# EAGLE design maintemp_revised_edition_2_20_18 (EAGLE 8.2.2)
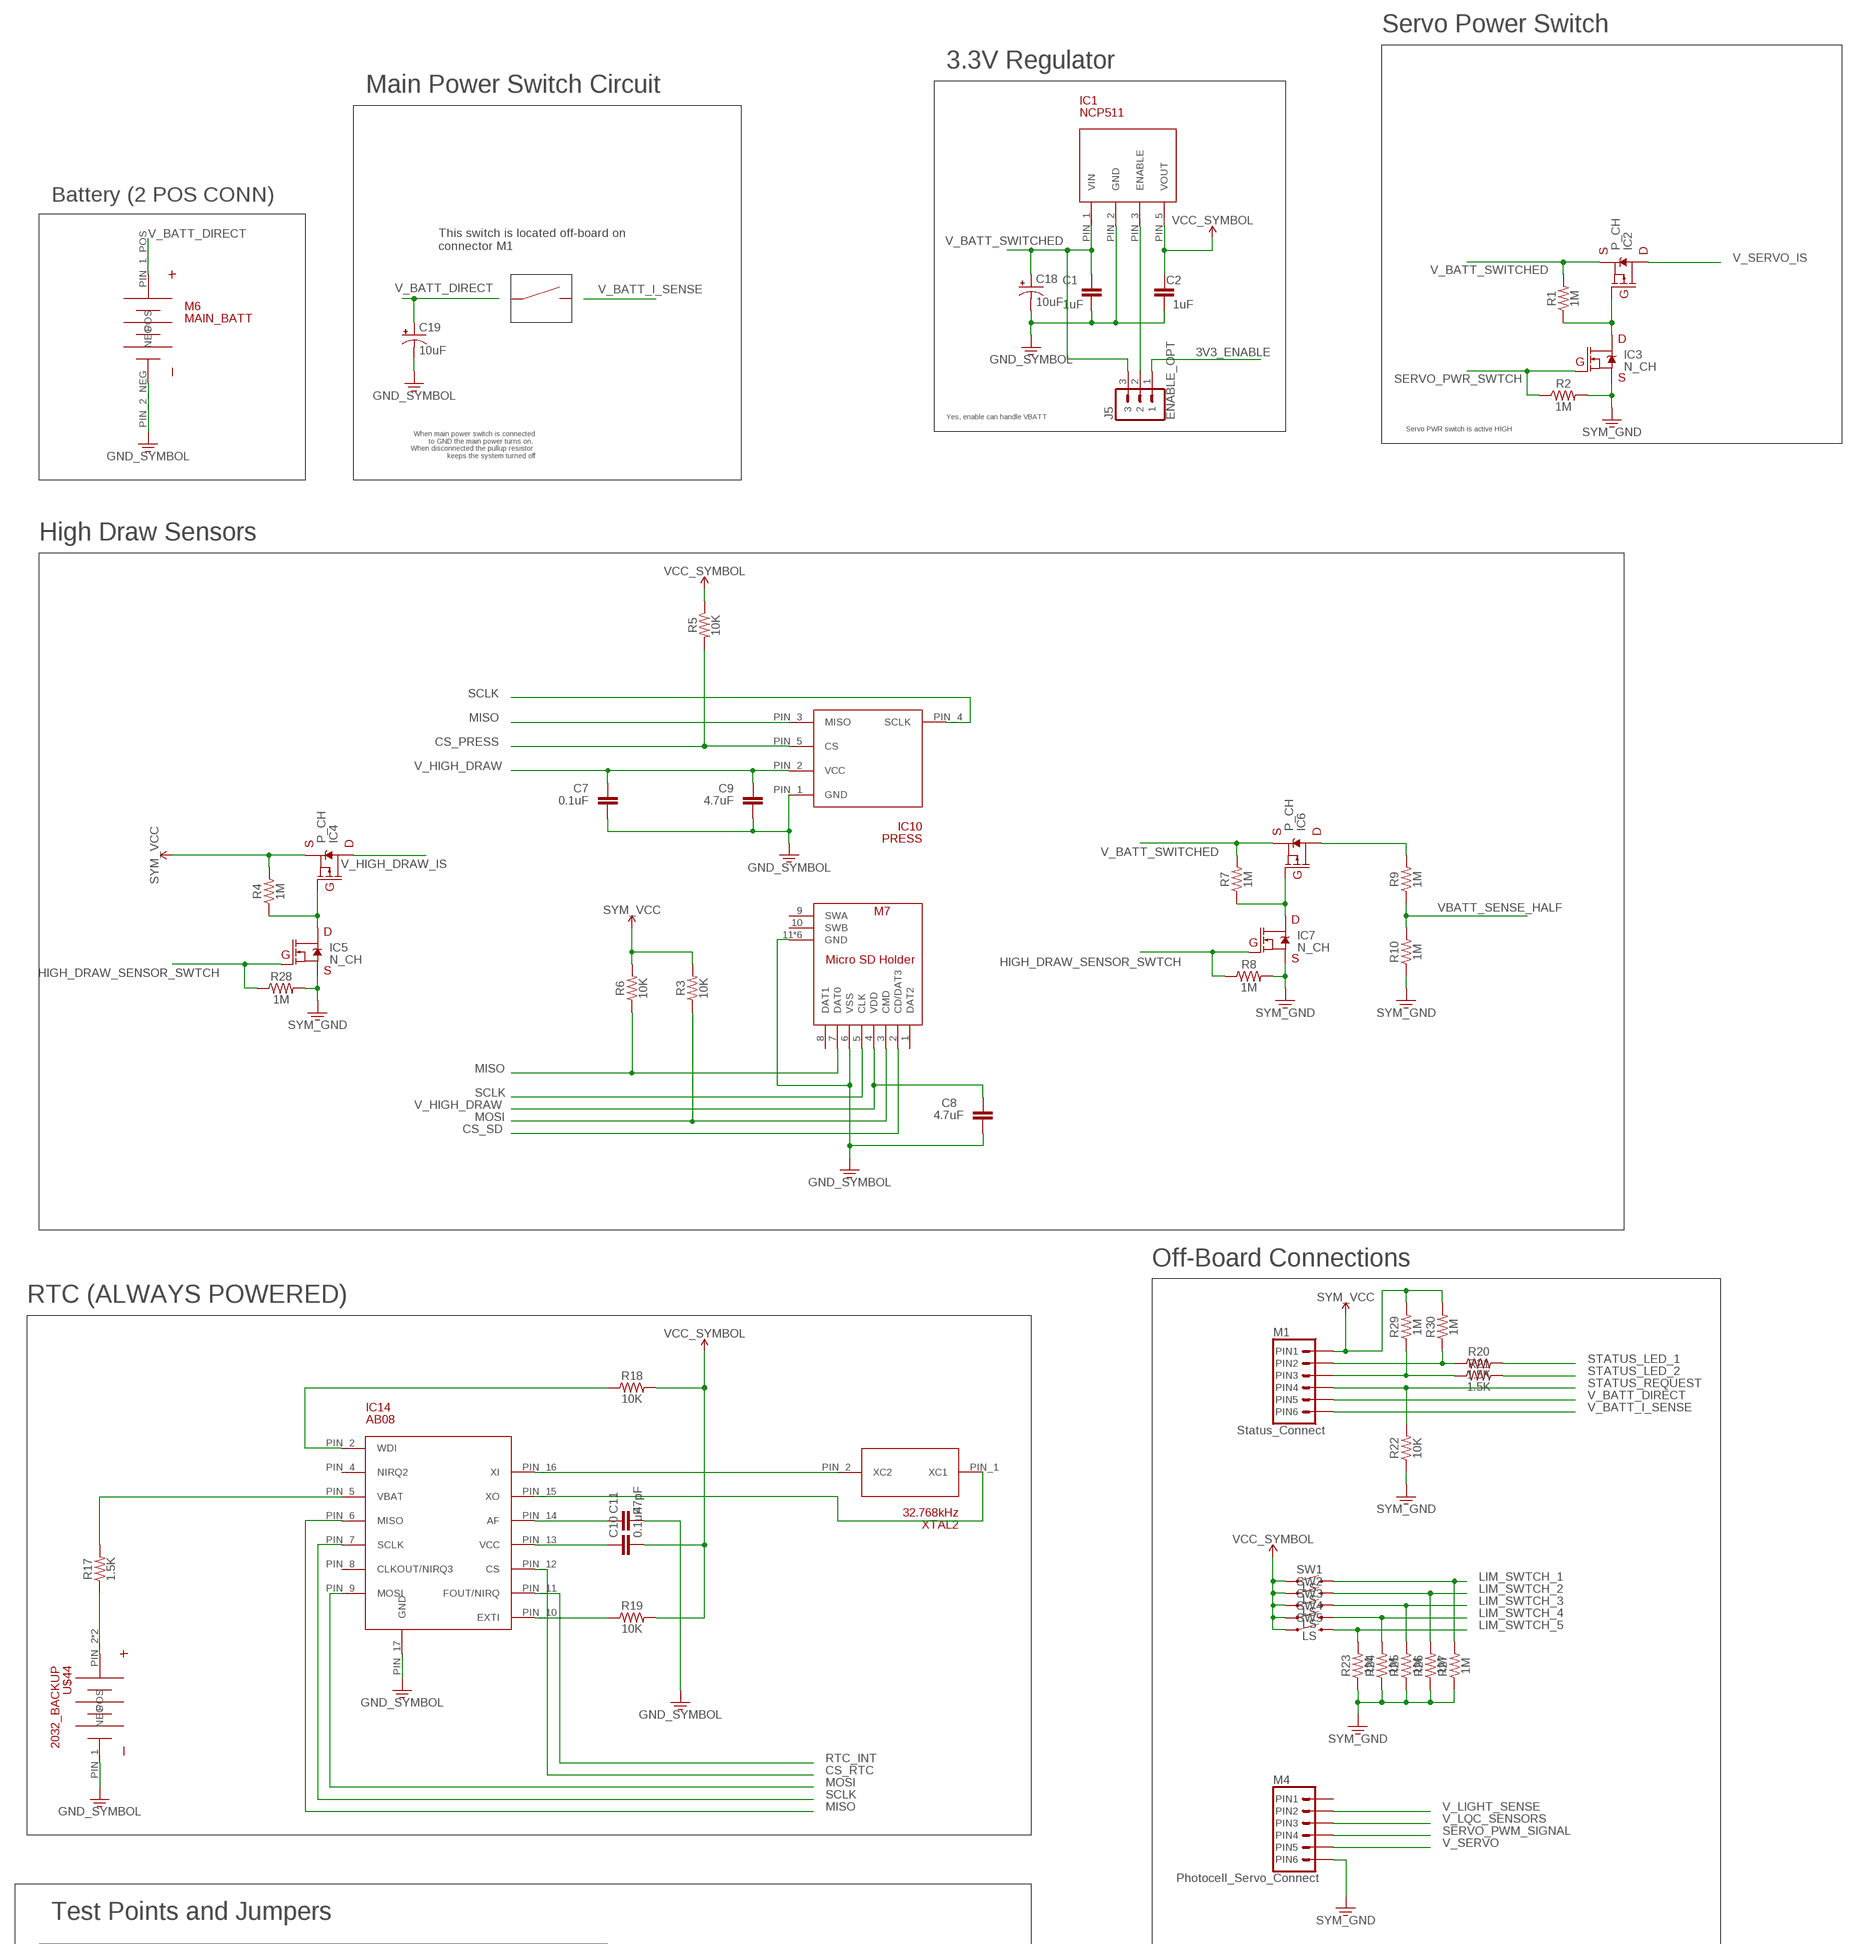
[diagram p0: schematic, sheet 1, part 1 of 3]
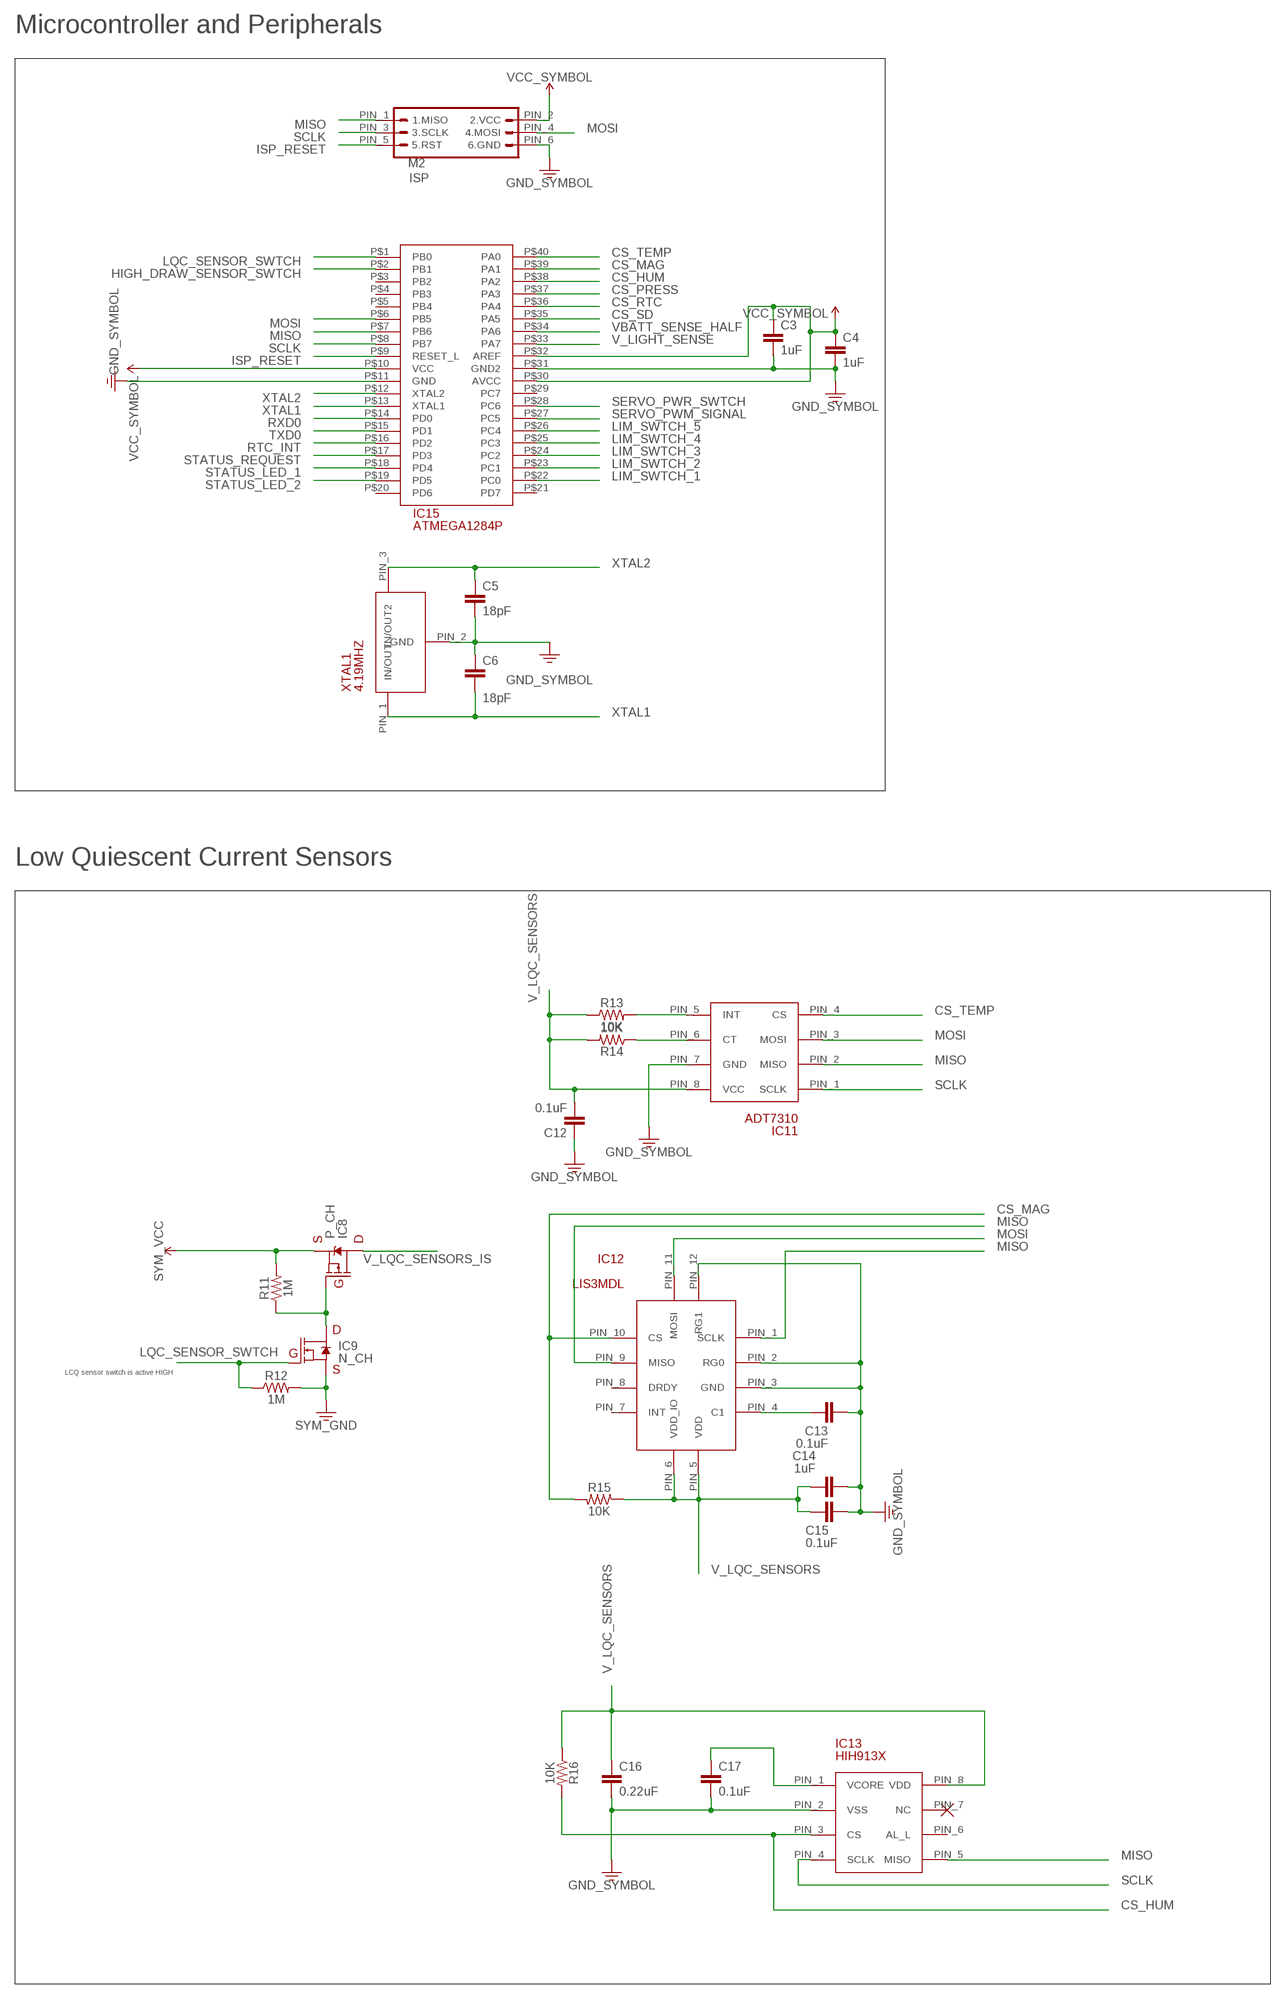
[diagram p1: schematic, sheet 1, part 2 of 3]
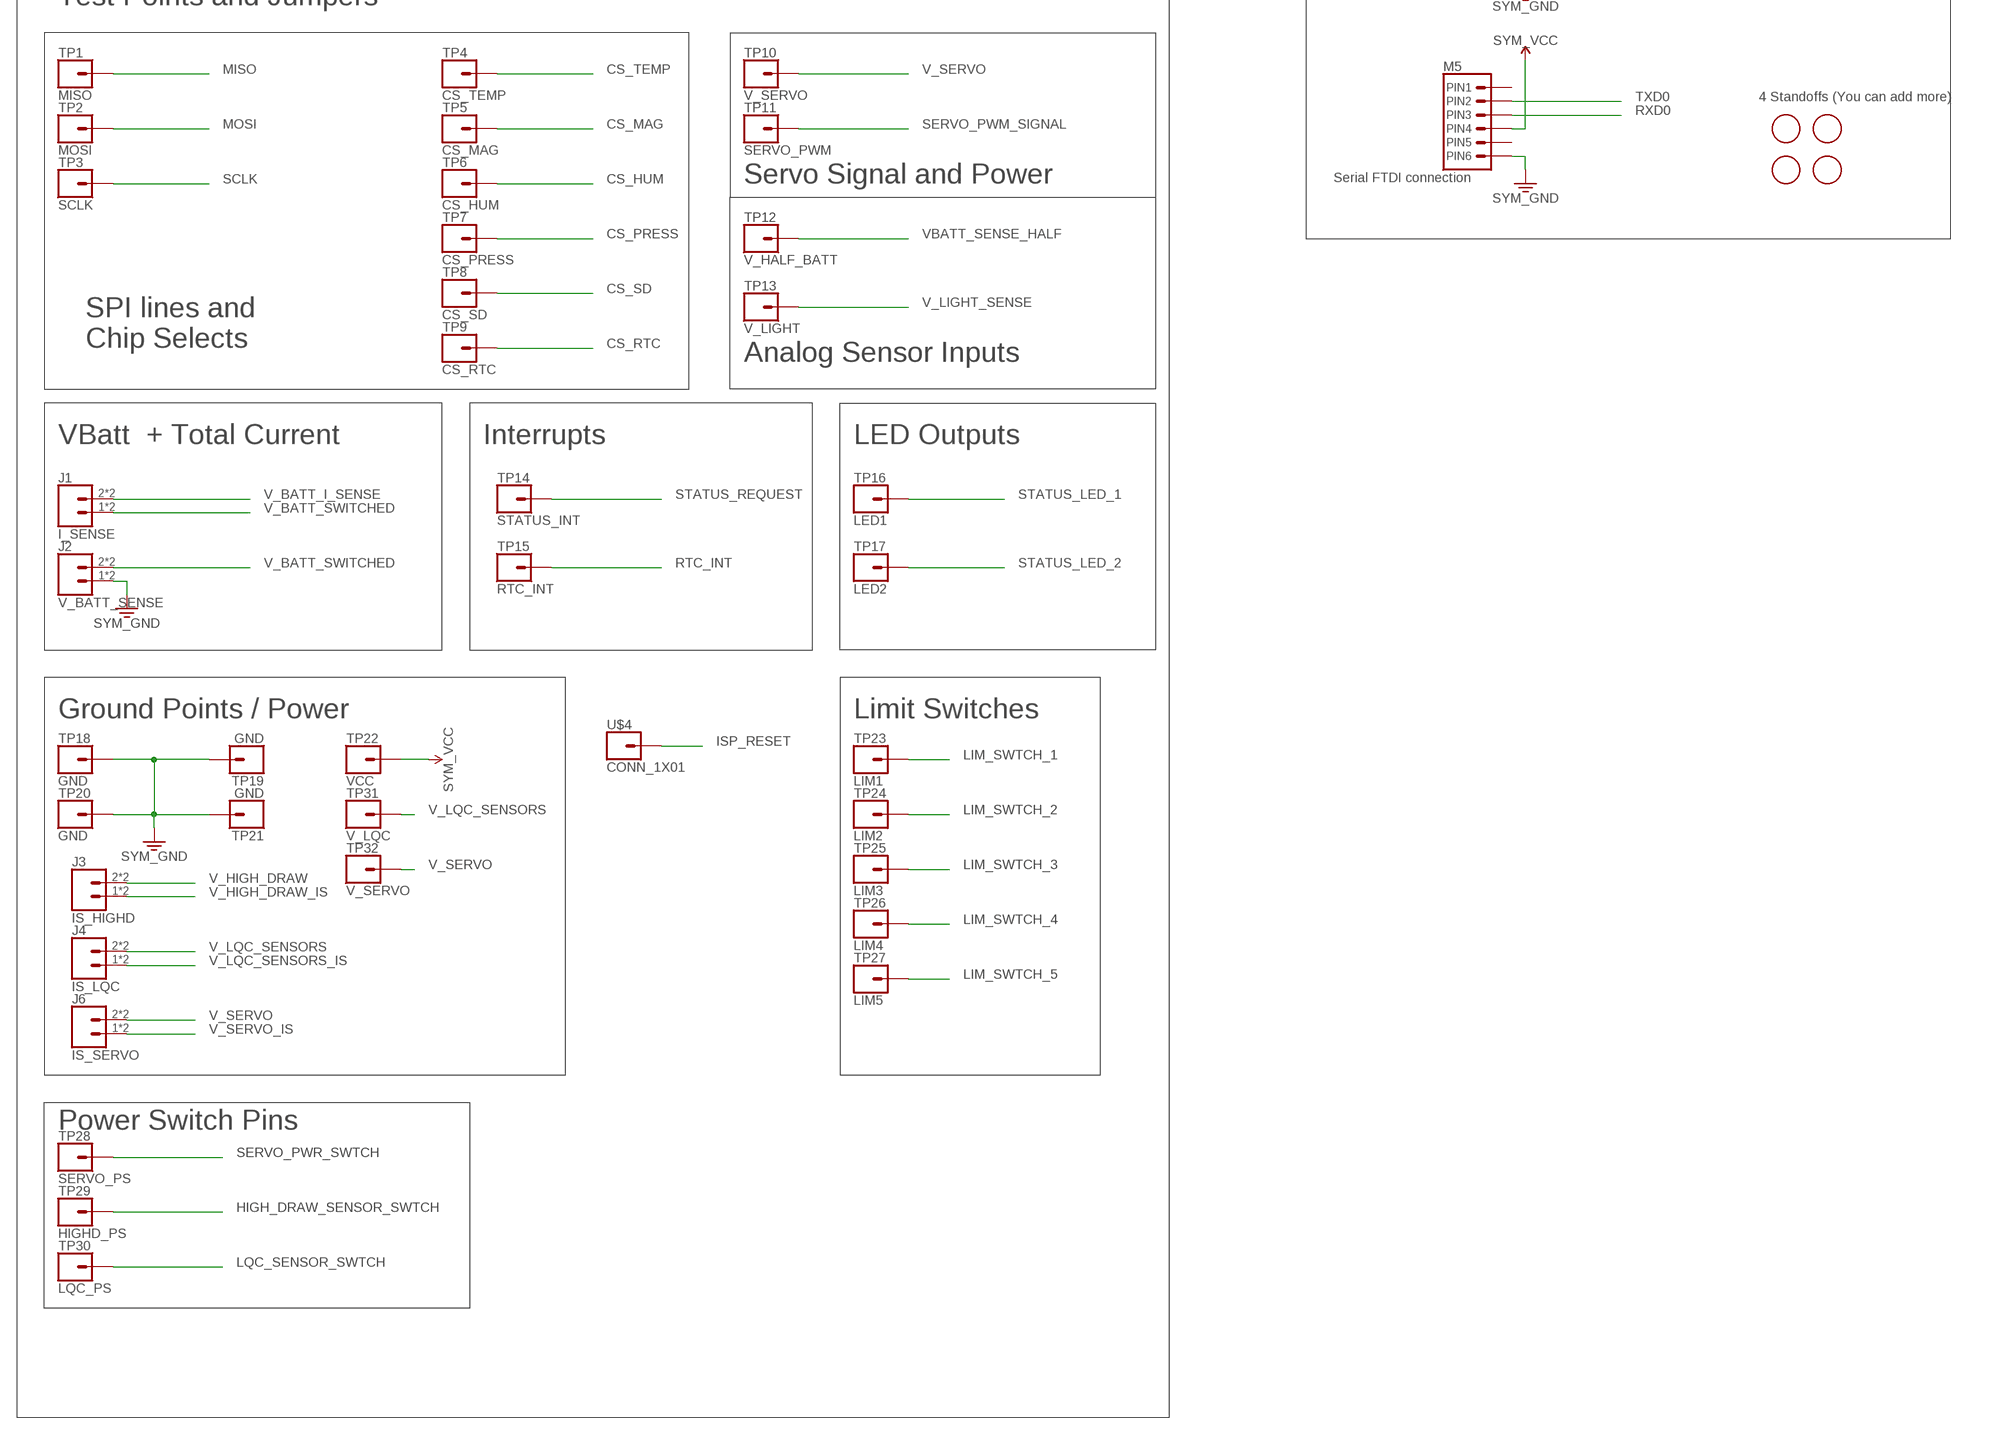
[diagram p2: schematic, sheet 1, part 3 of 3]

## Parts
C1  1uF  CAP_1UF  [SMD_0603]
C2  1uF  CAP_1UF  [SMD_0603]
C3  1uF  CAP_1UF  [SMD_0603]
C4  1uF  CAP_1UF  [SMD_0603]
C5  18pF  CAP_18PF  [SMD_0603]
C6  18pF  CAP_18PF  [SMD_0603]
C7  0.1uF  CAP_0.1UF  [SMD_0603]
C8  4.7uF  CAP_4.7UF  [SMD_0603]
C9  4.7uF  CAP_4.7UF  [SMD_0603]
C10  0.1uF  0.1UF_CAP  [0603]
C11  47pF  47PF_CAP  [0603]
C12  0.1uF  CAP_0.1UF  [SMD_0603]
C13  0.1uF  CAP_0.1UF  [SMD_0603]
C14  1uF  CAP_1UF  [SMD_0603]
C15  0.1uF  CAP_0.1UF  [SMD_0603]
C16  0.22uF  CAP_0.22UF  [SMD_0603]
C17  0.1uF  CAP_0.1UF  [SMD_0603]
C18  10uF  CAP_ELECTRO  [CAP-PTH-2.54]
C19  10uF  CAP_ELECTRO  [CAP-PTH-2.54]
IC1  NCP511  REG_NCP511  [TSOP-5]
IC2  P_CH  ZMISC_MOSFET_P_CHANNEL  [SOT23]
IC3  N_CH  ZMISC_MOSFET_N_CHANNEL  [SOT23]
IC4  P_CH  ZMISC_MOSFET_P_CHANNEL  [SOT23]
IC5  N_CH  ZMISC_MOSFET_N_CHANNEL  [SOT23]
IC6  P_CH  ZMISC_MOSFET_P_CHANNEL  [SOT23]
IC7  N_CH  ZMISC_MOSFET_N_CHANNEL  [SOT23]
IC8  P_CH  ZMISC_MOSFET_P_CHANNEL  [SOT23]
IC9  N_CH  ZMISC_MOSFET_N_CHANNEL  [SOT23]
IC10  PRESS  SENS_PRESS_RSC  [8-DIP]
IC11  ADT7310  TEMP_ADT7310  [SOIC-8]
IC12  LIS3MDL  MAG_LIS3MDL  [LGA-12]
IC13  HIH913X  HUM_HIH913X  [SOIC-8]
IC14  AB08  RTC_AB08  [QFN16_3X3]
IC15  ATMEGA1284P  UC_ATMEGA1284P  [40-DIP]
J1  I_SENSE  ZMISC_JUMPER  [1X02]
J2  V_BATT_SENSE  ZMISC_JUMPER  [1X02]
J3  IS_HIGHD  ZMISC_JUMPER  [1X02]
J4  IS_LQC  ZMISC_JUMPER  [1X02]
J5  ENABLE_OPT  CONN_1X03  [1X03]
J6  IS_SERVO  ZMISC_JUMPER  [1X02]
M1  Status_Connect  CONN_SERIAL  [1X06]
M2  ISP  CONN_ISP  [2X3]
M4  Photocell_Servo_Connect  CONN_SERIAL  [1X06]
M5  Serial FTDI connection  CONN_SERIAL  [1X06]
M6  MAIN_BATT  PWR_MAIN_BATT  [1-1318300-2]
M7  SD  SENS_MICRO-SD  [MICRO-SD]
R1  1M  RES_10K  [SMD_0603]
R2  1M  RES_10K  [SMD_0603]
R3  10K  RES_10K  [SMD_0603]
R4  1M  RES_10K  [SMD_0603]
R5  10K  RES_10K  [SMD_0603]
R6  10K  RES_10K  [SMD_0603]
R7  1M  RES_10K  [SMD_0603]
R8  1M  RES_10K  [SMD_0603]
R9  1M  RES_1M  [SMD_0603]
R10  1M  RES_1M  [SMD_0603]
R11  1M  RES_10K  [SMD_0603]
R12  1M  RES_10K  [SMD_0603]
R13  10K  RES_10K  [SMD_0603]
R14  10K  RES_10K  [SMD_0603]
R15  10K  RES_10K  [SMD_0603]
R16  10K  RES_10K  [SMD_0603]
R17  1.5K  1.5K_RES  [0603]
R18  10K  10K_RES  [0603]
R19  10K  10K_RES  [0603]
R20  1.5K  RES_1.5K  [SMD_0603]
R21  1.5K  RES_1.5K  [SMD_0603]
R22  10K  RES_10K  [SMD_0603]
R23  1M  RES_1M  [SMD_0603]
R24  1M  RES_1M  [SMD_0603]
R25  1M  RES_1M  [SMD_0603]
R26  1M  RES_1M  [SMD_0603]
R27  1M  RES_1M  [SMD_0603]
R28  1M  RES_10K  [SMD_0603]
R29  1M  RES_1M  [SMD_0603]
R30  1M  RES_1M  [SMD_0603]
SW1  LS  LIMITSWITCHBASE  [SNAPSWITCH]
SW2  LS  LIMITSWITCHBASE  [SNAPSWITCH]
SW3  LS  LIMITSWITCHBASE  [SNAPSWITCH]
SW4  LS  LIMITSWITCHBASE  [SNAPSWITCH]
SW5  LS  LIMITSWITCHBASE  [SNAPSWITCH]
TP1  MISO  CONN_1X01  [1X01]
TP2  MOSI  CONN_1X01  [1X01]
TP3  SCLK  CONN_1X01  [1X01]
TP4  CS_TEMP  CONN_1X01  [1X01]
TP5  CS_MAG  CONN_1X01  [1X01]
TP6  CS_HUM  CONN_1X01  [1X01]
TP7  CS_PRESS  CONN_1X01  [1X01]
TP8  CS_SD  CONN_1X01  [1X01]
TP9  CS_RTC  CONN_1X01  [1X01]
TP10  V_SERVO  CONN_1X01  [1X01]
TP11  SERVO_PWM  CONN_1X01  [1X01]
TP12  V_HALF_BATT  CONN_1X01  [1X01]
TP13  V_LIGHT  CONN_1X01  [1X01]
TP14  STATUS_INT  CONN_1X01  [1X01]
TP15  RTC_INT  CONN_1X01  [1X01]
TP16  LED1  CONN_1X01  [1X01]
TP17  LED2  CONN_1X01  [1X01]
TP18  GND  CONN_1X01  [1X01]
TP19  GND  CONN_1X01  [1X01]
TP20  GND  CONN_1X01  [1X01]
TP21  GND  CONN_1X01  [1X01]
TP22  VCC  CONN_1X01  [1X01]
TP23  LIM1  CONN_1X01  [1X01]
TP24  LIM2  CONN_1X01  [1X01]
TP25  LIM3  CONN_1X01  [1X01]
TP26  LIM4  CONN_1X01  [1X01]
TP27  LIM5  CONN_1X01  [1X01]
TP28  SERVO_PS  CONN_1X01  [1X01]
TP29  HIGHD_PS  CONN_1X01  [1X01]
TP30  LQC_PS  CONN_1X01  [1X01]
TP31  V_LQC  CONN_1X01  [1X01]
TP32  V_SERVO  CONN_1X01  [1X01]
U$4  CONN_1X01  [1X01]
U$7  STANDOFF  [STANDOFF]
U$11  STANDOFF  [STANDOFF]
U$13  STANDOFF  [STANDOFF]
U$17  STANDOFF  [STANDOFF]
U$44  2032_BACKUP  [2032]
XTAL1  4.19MHZ  ZMISC_XC  [AT49]
XTAL2  32.768kHz  XC_RTC  [ABS07]

## Nets
3V3_ENABLE: J5.1
CS_HUM: IC13.PIN_3(CS) IC15.P$38(PA2) R16.P$2 TP6.1
CS_MAG: IC12.PIN_10(CS) IC15.P$39(PA1) R15.P$2 TP5.1
CS_PRESS: IC10.PIN_5(CS) IC15.P$37(PA3) R5.P$2 TP7.1
CS_RTC: IC14.PIN_12(CS) IC15.P$36(PA4) TP9.1
CS_SD: IC15.P$35(PA5) M7.2(CD/DAT3) TP8.1
CS_TEMP: IC11.PIN_4(CS) IC15.P$40(PA0) TP4.1
GND: C1.P$2 C2.P$1 C3.P$2 C4.P$2 C5.P$2 C6.P$1 C7.P$2 C8.P$1 C9.P$2 C11.2 C12.P$1 C13.P$1 C14.P$1 C15.P$2 C16.P$2 C17.P$2 C18.2(-) C19.2(-) IC1.PIN_2(GND) IC3.2(S) IC5.2(S) IC7.2(S) IC9.2(S) IC10.PIN_1(GND) IC11.PIN_7(GND) IC12.PIN_2(RG0) IC12.PIN_3(GND) IC12.PIN_12(RG1) IC13.PIN_2(VSS) IC14.PIN_17(GND) IC15.P$11(GND) IC15.P$31(GND2) J2.1 J2.P$1 M2.PIN_6(6.GND) M4.1(PIN6) M5.1(PIN6) M6.PIN_2_NEG(NEG) M7.6(VSS) M7.11(GND) M7.12(GND) M7.13(GND) M7.14(GND) M7.15(GND) M7.16(GND) R2.P$2 R8.P$2 R10.P$1 R12.P$2 R22.P$1 R23.P$1 R24.P$1 R25.P$1 R26.P$1 R27.P$1 R28.P$2 TP18.1 TP19.1 TP20.1 TP21.1 U$44.PIN_1(NEG) XTAL1.PIN_2(GND) ; supply symbol labelled GND_SYMBOL, SYM_GND
HIGH_DRAW_SENSOR_SWTCH: IC5.1(G) IC7.1(G) IC15.P$2(PB1) R8.P$1 R28.P$1 TP29.1
ISP_RESET: IC15.P$9(RESET_L) M2.PIN_5(5.RST) U$4.1
LIM_SWTCH_1: IC15.P$22(PC0) R27.P$2 SW1.PIN_2 TP23.1
LIM_SWTCH_2: IC15.P$23(PC1) R26.P$2 SW2.PIN_2 TP24.1
LIM_SWTCH_3: IC15.P$24(PC2) R25.P$2 SW3.PIN_2 TP25.1
LIM_SWTCH_4: IC15.P$25(PC3) R24.P$2 SW4.PIN_2 TP26.1
LIM_SWTCH_5: IC15.P$26(PC4) R23.P$2 SW5.PIN_2 TP27.1
LQC_SENSOR_SWTCH: IC9.1(G) IC15.P$1(PB0) R12.P$1 TP30.1
MISO: IC10.PIN_3(MISO) IC11.PIN_2(MISO) IC12.PIN_1(SCLK) IC12.PIN_9(MISO) IC13.PIN_5(MISO) IC14.PIN_6(MISO) IC15.P$7(PB6) M2.PIN_1(1.MISO) M7.7(DAT0) R6.P$1 TP1.1
MOSI: IC11.PIN_3(MOSI) IC12.PIN_11(MOSI) IC14.PIN_9(MOSI) IC15.P$6(PB5) M2.PIN_4(4.MOSI) M7.3(CMD) R3.P$1 TP2.1
N$1: IC2.1(G) IC3.3(D) R1.P$1
N$5: C17.P$1 IC13.PIN_1(VCORE)
N$6: C13.P$2 IC12.PIN_4(C1)
N$7: IC14.PIN_2(WDI) R18.1
N$8: IC14.PIN_10(EXTI) R19.1
N$9: C10.1 IC14.PIN_13(VCC)
N$10: C11.1 IC14.PIN_14(AF)
N$11: IC14.PIN_15(XO) XTAL2.PIN_1(XC1)
N$12: IC14.PIN_16(XI) XTAL2.PIN_2(XC2)
N$13: R17.1 U$44.PIN_2(POS) U$44.PIN_3(POS)
N$14: IC14.PIN_5(VBAT) R17.2
N$15: IC11.PIN_5(INT) R13.P$2
N$16: IC11.PIN_6(CT) R14.P$1
N$17: IC1.PIN_3(ENABLE) J5.2
N$20: IC6.1(G) IC7.3(D) R7.P$1
N$22: IC4.1(G) IC5.3(D) R4.P$1
N$38: IC8.1(G) IC9.3(D) R11.P$1
N$L1: M1.5(PIN2) R20.P$1 R30.P$1
N$L2: M1.4(PIN3) R21.P$1 R29.P$1
RTC_INT: IC14.PIN_11(FOUT/NIRQ) IC15.P$16(PD2) TP15.1
RXD0: IC15.P$14(PD0) M5.4(PIN3)
SCLK: IC10.PIN_4(SCLK) IC11.PIN_1(SCLK) IC13.PIN_4(SCLK) IC14.PIN_7(SCLK) IC15.P$8(PB7) M2.PIN_3(3.SCLK) M7.5(CLK) TP3.1
SERVO_PWM_SIGNAL: IC15.P$27(PC5) M4.3(PIN4) TP11.1
SERVO_PWR_SWTCH: IC3.1(G) IC15.P$28(PC6) R2.P$1 TP28.1
STATUS_LED_1: IC15.P$18(PD4) R20.P$2 TP16.1
STATUS_LED_2: IC15.P$19(PD5) R21.P$2 TP17.1
STATUS_REQUEST: IC15.P$17(PD3) M1.3(PIN4) R22.P$2 TP14.1
TXD0: IC15.P$15(PD1) M5.5(PIN2)
V_BATT_DIRECT: C19.1(+) M1.2(PIN5) M6.PIN_1_POS(POS)
V_BATT_I_SENSE: J1.2 J1.P$2 M1.1(PIN6)
V_BATT_SENSE_WHOLE: IC6.3(D) R9.P$2
V_BATT_SWITCHED: C1.P$1 C18.1(+) IC1.PIN_1(VIN) IC2.2(S) IC6.2(S) J1.1 J1.P$1 J2.2 J2.P$2 J5.3 R1.P$2 R7.P$2
V_HIGH_DRAW: C7.P$1 C8.P$2 C9.P$1 IC10.PIN_2(VCC) J3.2 J3.P$2 M7.4(VDD)
V_HIGH_DRAW_IS: IC4.3(D) J3.1 J3.P$1
V_LIGHT_SENSE: IC15.P$33(PA7) M4.5(PIN2) TP13.1
V_LQC_SENSORS: C12.P$2 C14.P$2 C15.P$1 C16.P$1 IC11.PIN_8(VCC) IC12.PIN_5(VDD) IC12.PIN_6(VDD_IO) IC13.PIN_8(VDD) J4.2 J4.P$2 M4.4(PIN3) R13.P$1 R14.P$2 R15.P$1 R16.P$1 TP31.1
V_LQC_SENSORS_IS: IC8.3(D) J4.1 J4.P$1
V_SERVO: J6.2 J6.P$2 M4.2(PIN5) TP10.1 TP32.1
V_SERVO_IS: IC2.3(D) J6.1 J6.P$1
VBATT_SENSE_HALF: IC15.P$34(PA6) R9.P$1 R10.P$2 TP12.1
VCC: C2.P$2 C3.P$1 C4.P$1 C10.2 IC1.PIN_5(VOUT) IC4.2(S) IC8.2(S) IC15.P$10(VCC) IC15.P$30(AVCC) IC15.P$32(AREF) M1.6(PIN1) M2.PIN_2(2.VCC) M5.3(PIN4) R3.P$2 R4.P$2 R5.P$1 R6.P$2 R11.P$2 R18.2 R19.2 R29.P$2 R30.P$2 SW1.PIN_1 SW2.PIN_1 SW3.PIN_1 SW4.PIN_1 SW5.PIN_1 TP22.1 ; supply symbol labelled VCC_SYMBOL, SYM_VCC
XTAL1: C6.P$2 IC15.P$13(XTAL1) XTAL1.PIN_1(IN/OUT)
XTAL2: C5.P$1 IC15.P$12(XTAL2) XTAL1.PIN_3(IN/OUT2)
Unconnected: IC12.PIN_7(INT) IC12.PIN_8(DRDY) IC13.PIN_6(AL_L) IC13.PIN_7(NC) IC14.PIN_4(NIRQ2) IC14.PIN_8(CLKOUT/NIRQ3) IC15.P$3(PB2) IC15.P$4(PB3) IC15.P$5(PB4) IC15.P$20(PD6) IC15.P$21(PD7) IC15.P$29(PC7) M4.6(PIN1) M5.2(PIN5) M5.6(PIN1) M7.1(DAT2) M7.8(DAT1) M7.9(SWA) M7.10(SWB)

## Notes on the sheet
- Microcontroller and Peripherals
- Servo Power Switch
- 3.3V Regulator
- Main Power Switch Circuit
- Battery (2 POS CONN)
- This switch is located off-board on 
  connector M1
- Yes, enable can handle VBATT
- When main power switch is connected
   to GND the main power turns on. 
  When disconnected the pullup resistor 
  keeps the system turned off
- Servo PWR switch is active HIGH
- High Draw Sensors
- Low Quiescent Current Sensors
- Off-Board Connections
- RTC (ALWAYS POWERED)
- LCQ sensor switch is active HIGH
- Test Points and Jumpers
- 4 Standoffs (You can add more)
- Servo Signal and Power
- SPI lines and 
  Chip Selects
- Analog Sensor Inputs
- VBatt  + Total Current | Interrupts | LED Outputs
- Ground Points / Power | Limit Switches
- Power Switch Pins

## Library data of the parts
C1-C4 C14 = SNWCT_EAGLE_LBR:CAP_1UF
C5 C6 = SNWCT_EAGLE_LBR:CAP_18PF
C7 C12 C13 C15 C17 = SNWCT_EAGLE_LBR:CAP_0.1UF
C8 C9 = SNWCT_EAGLE_LBR:CAP_4.7UF
C10 = SNWCT_EAGLE_LBR:0.1UF_CAP
C11 = SNWCT_EAGLE_LBR:47PF_CAP
C16 = SNWCT_EAGLE_LBR:CAP_0.22UF
C18 C19 = SNWCT_EAGLE_LBR:CAP_ELECTRO
IC1 = SNWCT_EAGLE_LBR:REG_NCP511
IC2 IC4 IC6 IC8 = SNWCT_EAGLE_LBR:ZMISC_MOSFET_P_CHANNEL
IC3 IC5 IC7 IC9 = SNWCT_EAGLE_LBR:ZMISC_MOSFET_N_CHANNEL
IC10 = SNWCT_EAGLE_LBR:SENS_PRESS_RSC
IC11 = SNWCT_EAGLE_LBR:TEMP_ADT7310
IC12 = SNWCT_EAGLE_LBR:MAG_LIS3MDL
IC13 = SNWCT_EAGLE_LBR:HUM_HIH913X: SPI Humidity sensor Digikey:480-5707-6-ND
IC14 = SNWCT_EAGLE_LBR:RTC_AB08
IC15 = SNWCT_EAGLE_LBR:UC_ATMEGA1284P
J1-J4 J6 = SNWCT_EAGLE_LBR:ZMISC_JUMPER
J5 = SNWCT_EAGLE_LBR:CONN_1X03
M1 M4 M5 = SNWCT_EAGLE_LBR:CONN_SERIAL
M2 = SNWCT_EAGLE_LBR:CONN_ISP
M6 = SNWCT_EAGLE_LBR:PWR_MAIN_BATT
M7 = SNWCT_EAGLE_LBR:SENS_MICRO-SD
R1-R8 R11-R16 R22 R28 = SNWCT_EAGLE_LBR:RES_10K
R9 R10 R23-R27 R29 R30 = SNWCT_EAGLE_LBR:RES_1M
R17 = SNWCT_EAGLE_LBR:1.5K_RES
R18 R19 = SNWCT_EAGLE_LBR:10K_RES
R20 R21 = SNWCT_EAGLE_LBR:RES_1.5K
SW1-SW5 = SNWCT_EAGLE_LBR:LIMITSWITCH
TP1-TP32 U$4 = SNWCT_EAGLE_LBR:CONN_1X01
U$7 U$11 U$13 U$17 = SNWCT_EAGLE_LBR:STANDOFF
U$44 = SNWCT_EAGLE_LBR:2032_BACKUP
XTAL1 = SNWCT_EAGLE_LBR:ZMISC_XC
XTAL2 = SNWCT_EAGLE_LBR:XC_RTC

## Board
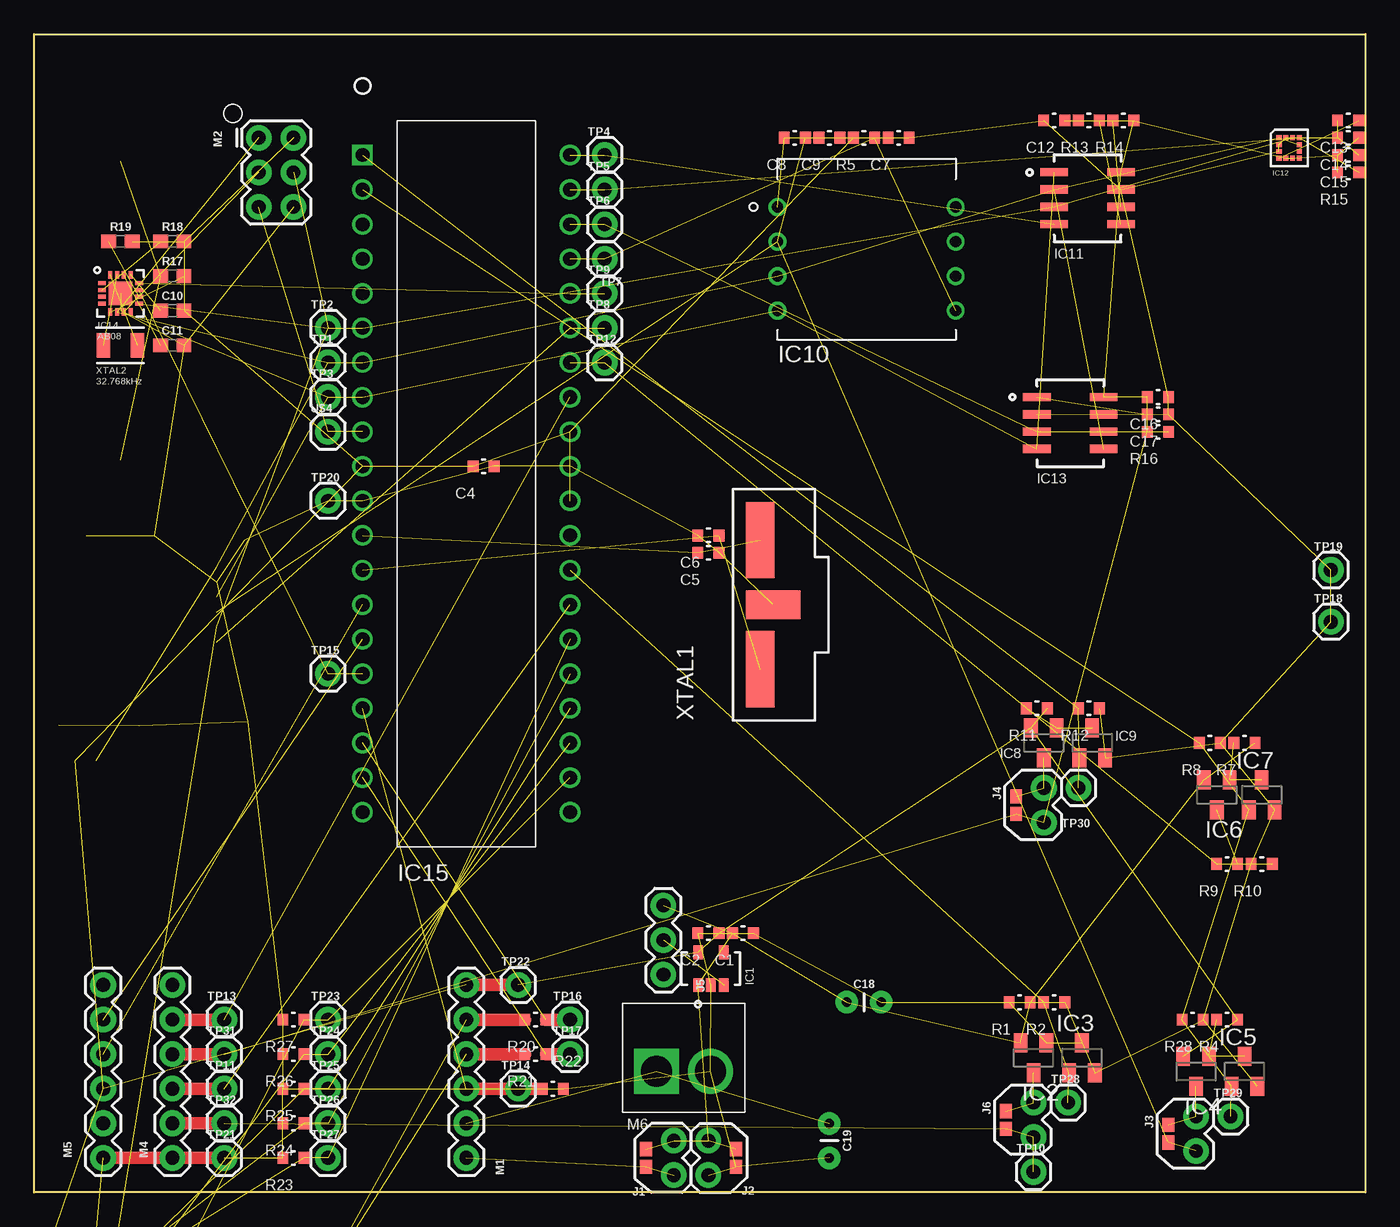
[diagram p3: board, top side]
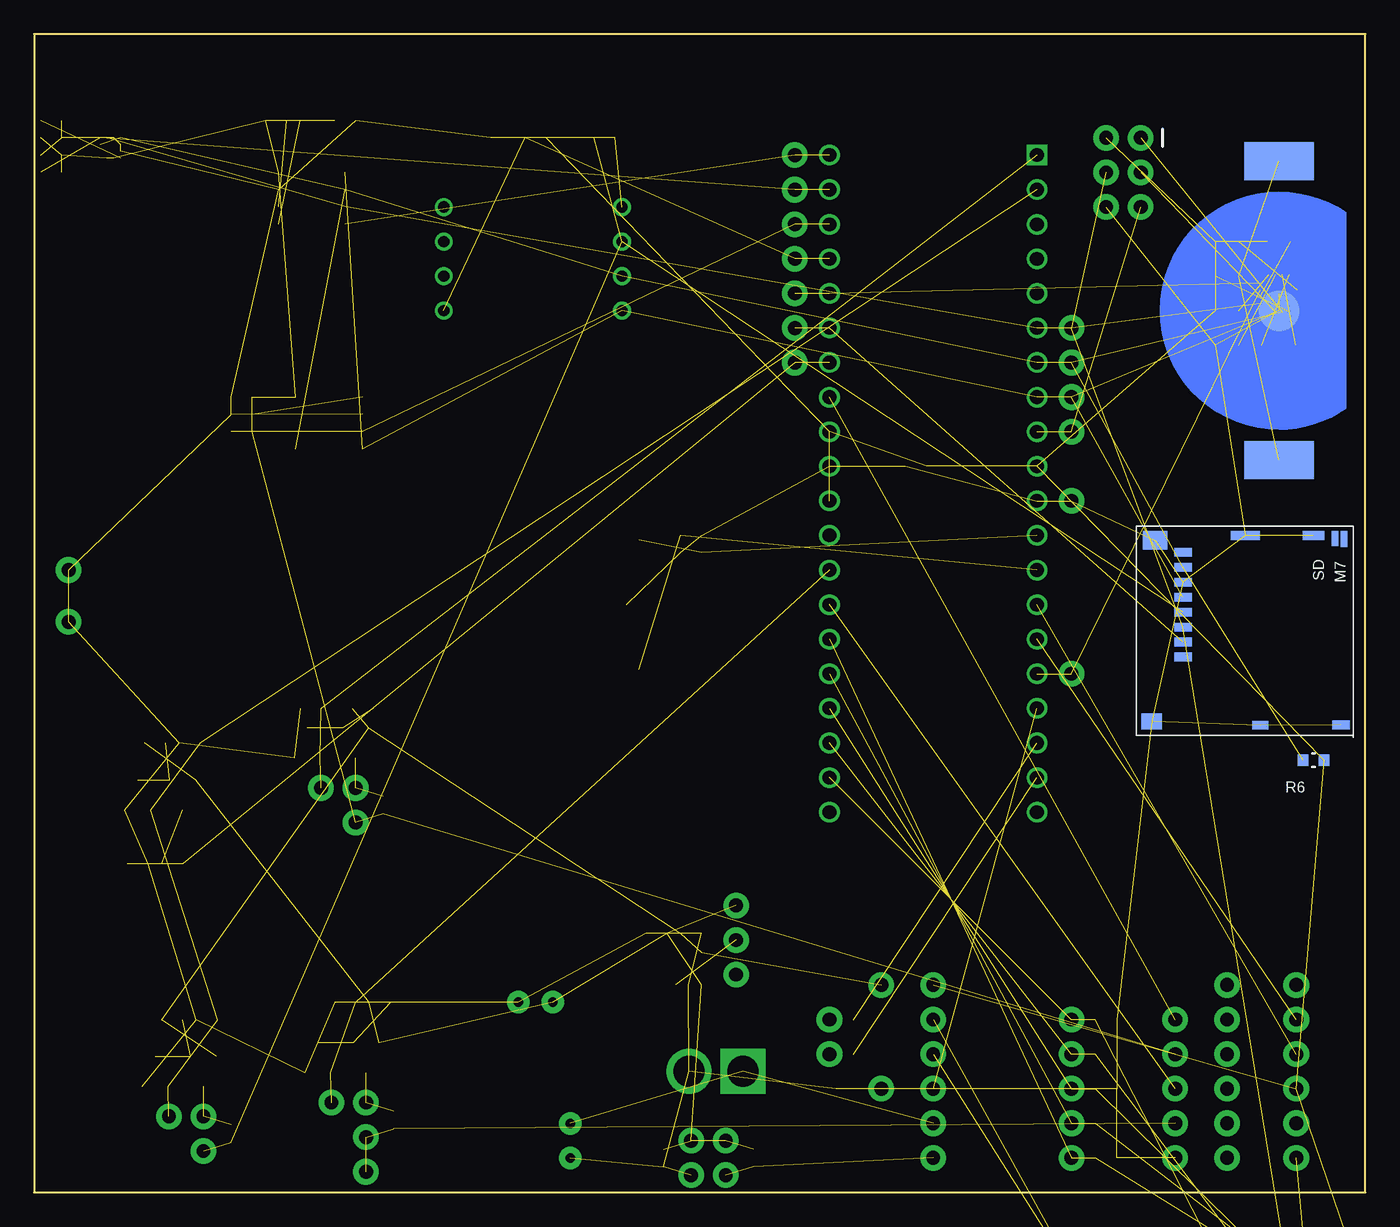
[diagram p4: board, bottom side, seen from below]

Size 97.79 x 85.09 mm. Coordinates in mm from the lower left corner, seen from the top.
Outline: 0,80 0,0
Outline: 0,0 0,85.09 97.79,85.09 97.79,0 0,0
Copper layers (1*16): Top 0.035mm / dielectric 1.5mm / Bottom 0.035mm
Design rules "default": minimum track width 6mil, minimum drill 0.35mm, track to track 6mil, track to pad 6mil, pad to pad 6mil, via to via 6mil, smd to smd 6mil, copper to edge 40mil, drill to drill 6mil, minimum pad ring 10mil, minimum via ring 8mil, stop-mask expansion 4mil, vias tented up to drill 0mil, thermal gap 10mil

### Footprints (pad centres in the part's own frame; a part is rotated, then mirrored left to right if it is on the bottom)
SMD_0603 = smd 0.787 x 0.864: P$1 -0.774,0; P$2 0.775,0
0603 = smd 1.1 x 1: 1 -0.85,0; 2 0.85,0
CAP-PTH-2.54 = drill 0.7 pad 1.651: 1 -1.27,0; 2 1.27,0
TSOP-5 = smd 0.7 x 1: PIN_1 0,0; PIN_2 0.95,0; PIN_3 1.9,0; PIN_4 1.9,2.4; PIN_5 0,2.4
SOT23 = smd 1 x 1.4: 1 -0.95,-1.1; 2 0.95,-1.1; 3 0,1.1
8-DIP = drill 0.813: PIN_1 0,0; PIN_2 2.54,0; PIN_3 5.08,0; PIN_4 7.62,0; PIN_5 7.62,13.081; PIN_6 5.08,13.081; PIN_7 2.54,13.081; PIN_8 0,13.081
SOIC-8 = smd 2.03 x 0.61: PIN_1 0,0.01; PIN_2 0,-1.26; PIN_3 0,-2.53; PIN_4 0,-3.8; PIN_5 4.9,-3.8; PIN_6 4.9,-2.53; PIN_7 4.9,-1.26; PIN_8 4.9,0.01
LGA-12 = smd 0.375 x 0.35: PIN_1 0,0; PIN_2 0,-0.5; PIN_3 0,-1; PIN_4 0,-1.5; PIN_7 1.5,-1.5; PIN_8 1.5,-1; PIN_9 1.5,-0.5; PIN_10 1.5,0 | smd 0.35 x 0.375: PIN_5 0.5,-1.5; PIN_6 1,-1.5; PIN_11 1,0; PIN_12 0.5,0
QFN16_3X3 = smd 0.58 x 0.3: PIN_1 -1.36,0.75; PIN_2 -1.36,0.25; PIN_3 -1.36,-0.25; PIN_4 -1.36,-0.75; PIN_9 1.36,-0.75; PIN_10 1.36,-0.25; PIN_11 1.36,0.25; PIN_12 1.36,0.75 | smd 0.3 x 0.58: PIN_5 -0.75,-1.36; PIN_6 -0.25,-1.36; PIN_7 0.25,-1.36; PIN_8 0.75,-1.36; PIN_13 0.75,1.36; PIN_14 0.25,1.36; PIN_15 -0.25,1.36; PIN_16 -0.75,1.36 | smd 1.74 x 1.74: PIN_17 0,0
40-DIP = drill 1 square: P$1 0,0 | drill 1: P$2 2.54,0; P$3 5.08,0; P$4 7.62,0; P$5 10.16,0; P$6 12.7,0; P$7 15.24,0; P$8 17.78,0; P$9 20.32,0; P$10 22.86,0; P$11 25.4,0; P$12 27.94,0; P$13 30.48,0; P$14 33.02,0; P$15 35.56,0; P$16 38.1,0; P$17 40.64,0; P$18 43.18,0; P$19 45.72,0; P$20 48.26,0; P$21 48.26,15.24; P$22 45.72,15.24; P$23 43.18,15.24; P$24 40.64,15.24; P$25 38.1,15.24; P$26 35.56,15.24; P$27 33.02,15.24; P$28 30.48,15.24; P$29 27.94,15.24; P$30 25.4,15.24; P$31 22.86,15.24; P$32 20.32,15.24; P$33 17.78,15.24; P$34 15.24,15.24; P$35 12.7,15.24; P$36 10.16,15.24; P$37 7.62,15.24; P$38 5.08,15.24; P$39 2.54,15.24; P$40 0,15.24
1X02 = drill 1.016 pad 1.88: 1 0,0; 2 2.54,0 | smd 1.041 x 0.864: P$1 0.622,-2.032; P$2 1.918,-2.032
1X03 = drill 1.016 pad 1.88: 1 0,0; 2 2.54,0; 3 5.08,0
1X06 = drill 1.016 pad 1.88: 1 0,0; 2 2.54,0; 3 5.08,0; 4 7.62,0; 5 10.16,0; 6 12.7,0
2X3 = drill 1.016 pad 1.88: PIN_1 0,0; PIN_2 0,2.54; PIN_3 2.54,0; PIN_4 2.54,2.54; PIN_5 5.08,0; PIN_6 5.08,2.54
1-1318300-2 = drill 2.286 square: PIN_1_POS 0,0 | drill 2.286: PIN_2_NEG 3.96,0
MICRO-SD = smd 0.635 x 1.27: 1 3.85,-0.7; 2 2.75,-0.7; 3 1.65,-0.7; 4 0.55,-0.7; 5 -0.55,-0.7; 6 -1.65,-0.7; 7 -2.75,-0.7; 8 -3.85,-0.7 | smd 1.15 x 0.45: 9 -4.815,11.125 | smd 1.11 x 0.45: 10 -4.845,10.465 | smd 1.35 x 1.8: 11 -4.715,-2.75 | smd 0.65 x 2.14: 12 -5.065,3.88 | smd 0.65 x 1.6: 13 -5.065,8.882 | smd 0.65 x 1.3: 14 8.835,10.9 | smd 0.6 x 1.15: 15 8.86,4.975 | smd 1.16 x 1.5: 16 8.58,-3
SNAPSWITCH = smd 4.572 x 1.27 bottom: PIN_1 0,0; PIN_2 0,-7.62
1X01 = drill 1.016 pad 1.88: 1 0,0
2032 = smd 3 x 3: PIN_1 0,0 | smd 2.79 x 5.08: PIN_2 -10.985,0; PIN_3 10.985,0
AT49 = smd 5.6 x 2.1: PIN_1 -4.75,0; PIN_3 4.75,0 | smd 2.1 x 4: PIN_2 0,-0.95
ABS07 = smd 1 x 1.8: PIN_1 -1.25,0; PIN_2 1.25,0

### Placement (x,y rotation side)
C1  52.07,19.05 0 top
C2  49.53,19.05 0 top
C3  -1.27,-58.42 0 top  (outside the outline)
C4  33.02,53.34 0 top
C5  49.53,46.99 0 top
C6  49.53,48.26 0 top
C7  63.5,77.47 0 top
C8  55.88,77.47 0 top
C9  58.42,77.47 0 top
C10  10.16,64.77 0 top
C11  10.16,62.23 0 top
C12  74.93,78.74 0 top
C13  96.52,78.74 0 top
C14  96.52,77.47 0 top
C15  96.52,76.2 0 top
C16  82.55,58.42 0 top
C17  82.55,57.15 0 top
C18  60.96,13.97 0 top
C19  58.42,3.81 270 top
IC1  48.77,15.24 0 top
IC2  73.41,9.91 180 top
IC3  76.96,9.91 0 top
IC4  85.34,8.89 180 top
IC5  88.9,8.89 0 top
IC6  86.87,29.21 180 top
IC7  90.17,29.21 0 top
IC8  74.17,33.02 180 top
IC9  77.72,33.02 0 top
IC10  54.61,72.39 270 top
IC11  74.93,74.93 0 top
IC12  91.44,77.47 0 top
IC13  73.66,58.42 0 top
IC14  6.35,66.04 0 top
IC15  24.13,76.2 270 top
J1  46.99,3.81 270 top
J2  49.53,1.27 90 top
J3  85.34,5.59 270 top
J4  74.17,29.72 270 top
J5  46.23,16 90 top
J6  73.41,6.6 270 top
M1  31.75,2.54 90 top
M2  16.51,77.47 270 top
M4  10.16,2.54 90 top
M5  5.08,2.54 90 top
M6  45.72,8.89 0 top
M7  12.7,43.18 270 bottom
R1  72.39,13.97 0 top
R2  74.93,13.97 0 top
R3  -1.27,-53.34 0 top  (outside the outline)
R4  87.63,12.7 0 top
R5  60.96,77.47 0 top
R6  3.81,31.75 0 bottom
R7  88.9,33.02 0 top
R8  86.36,33.02 0 top
R9  87.63,24.13 0 top
R10  90.17,24.13 0 top
R11  73.66,35.56 0 top
R12  77.47,35.56 0 top
R13  77.47,78.74 0 top
R14  80.01,78.74 0 top
R15  96.52,74.93 0 top
R16  82.55,55.88 0 top
R17  10.16,67.31 0 top
R18  10.16,69.85 0 top
R19  6.35,69.85 0 top
R20  36.83,12.7 0 top
R21  36.83,10.16 0 top
R22  38.1,7.62 180 top
R23  19.05,2.54 0 top
R24  19.05,5.08 0 top
R25  19.05,7.62 0 top
R26  19.05,10.16 0 top
R27  19.05,12.7 0 top
R28  85.09,12.7 0 top
R29  -1.27,-43.18 0 top  (outside the outline)
R30  -1.27,-48.26 0 top  (outside the outline)
SW1  -11.43,-40.64 0 top  (outside the outline)
SW2  -24.13,-40.64 0 top  (outside the outline)
SW3  -36.83,-40.64 0 top  (outside the outline)
SW4  -49.53,-40.64 0 top  (outside the outline)
SW5  -62.23,-40.64 0 top  (outside the outline)
TP1  21.59,60.96 0 top
TP2  21.59,63.5 0 top
TP3  21.59,58.42 0 top
TP4  41.91,76.2 0 top
TP5  41.91,73.66 0 top
TP6  41.91,71.12 0 top
TP7  41.91,68.58 180 top
TP8  41.91,63.5 0 top
TP9  41.91,66.04 0 top
TP10  73.41,1.52 0 top
TP11  13.97,7.62 0 top
TP12  41.91,60.96 0 top
TP13  13.97,12.7 0 top
TP14  35.56,7.62 0 top
TP15  21.59,38.1 0 top
TP16  39.37,12.7 0 top
TP17  39.37,10.16 0 top
TP18  95.25,41.91 0 top
TP19  95.25,45.72 0 top
TP20  21.59,50.8 0 top
TP21  13.97,2.54 0 top
TP22  35.56,15.24 0 top
TP23  21.59,12.7 0 top
TP24  21.59,10.16 0 top
TP25  21.59,7.62 0 top
TP26  21.59,5.08 0 top
TP27  21.59,2.54 0 top
TP28  75.95,6.6 0 top
TP29  87.88,5.59 0 top
TP30  76.71,29.72 0 top
TP31  13.97,10.16 0 top
TP32  13.97,5.08 0 top
U$4  21.59,55.88 0 top
U$7  -64.77,-64.77 0 top  (outside the outline)
U$11  -64.77,-71.12 0 top  (outside the outline)
U$13  -64.77,-77.47 0 top  (outside the outline)
U$17  -64.77,-83.82 0 top  (outside the outline)
U$44  6.35,64.77 90 bottom
XTAL1  53.34,43.18 90 top
XTAL2  6.35,62.23 0 top

### Tracks (layer width: path | path; a pad name or v marks a point on that pad's centre or on a via)
CS_HUM  (3 unrouted)
CS_MAG  (3 unrouted)
CS_PRESS  (3 unrouted)
CS_RTC  (2 unrouted)
CS_SD  (2 unrouted)
CS_TEMP  (2 unrouted)
GND  (59 unrouted)
  Top 0.914: TP21.1 M4.1 M5.1
HIGH_DRAW_SENSOR_SWTCH  (5 unrouted)
ISP_RESET  (2 unrouted)
LIM_SWTCH_1  (3 unrouted)
LIM_SWTCH_2  (3 unrouted)
LIM_SWTCH_3  (3 unrouted)
LIM_SWTCH_4  (3 unrouted)
LIM_SWTCH_5  (3 unrouted)
LQC_SENSOR_SWTCH  (3 unrouted)
MISO  (10 unrouted)
MOSI  (7 unrouted)
N$1  (2 unrouted)
N$5  (1 unrouted)
N$6  (1 unrouted)
N$7  (1 unrouted)
N$8  (1 unrouted)
N$9  (1 unrouted)
N$10  (1 unrouted)
N$11  (1 unrouted)
N$12  (1 unrouted)
N$13  (2 unrouted)
N$14  (1 unrouted)
N$15  (1 unrouted)
N$16  (1 unrouted)
N$17  (1 unrouted)
N$20  (2 unrouted)
N$22  (2 unrouted)
N$38  (2 unrouted)
N$L1  (1 unrouted)
  Top 0.914: R20.P$1 M1.5
N$L2  (1 unrouted)
  Top 0.914: R21.P$1 M1.4
RTC_INT  (2 unrouted)
RXD0  (1 unrouted)
SCLK  (7 unrouted)
SERVO_PWM_SIGNAL  (1 unrouted)
  Top 0.914: TP11.1 M4.3
SERVO_PWR_SWTCH  (3 unrouted)
STATUS_LED_1  (1 unrouted)
  Top 0.914: R20.P$2 TP16.1
STATUS_LED_2  (1 unrouted)
  Top 0.914: R21.P$2 TP17.1
STATUS_REQUEST  (1 unrouted)
  Top 0.914: M1.3 TP14.1 R22.P$2
TXD0  (1 unrouted)
V_BATT_DIRECT  (2 unrouted)
V_BATT_I_SENSE  (2 unrouted)
V_BATT_SENSE_WHOLE  (1 unrouted)
V_BATT_SWITCHED  (11 unrouted)
V_HIGH_DRAW  (6 unrouted)
V_HIGH_DRAW_IS  (2 unrouted)
V_LIGHT_SENSE  (1 unrouted)
  Top 0.914: TP13.1 M4.5
V_LQC_SENSORS  (14 unrouted)
  Top 0.914: TP31.1 M4.4
V_LQC_SENSORS_IS  (2 unrouted)
V_SERVO  (3 unrouted)
  Top 0.914: TP32.1 M4.2
V_SERVO_IS  (2 unrouted)
VBATT_SENSE_HALF  (3 unrouted)
VCC  (26 unrouted)
  Top 0.914: M1.6 TP22.1
XTAL1  (2 unrouted)
XTAL2  (2 unrouted)